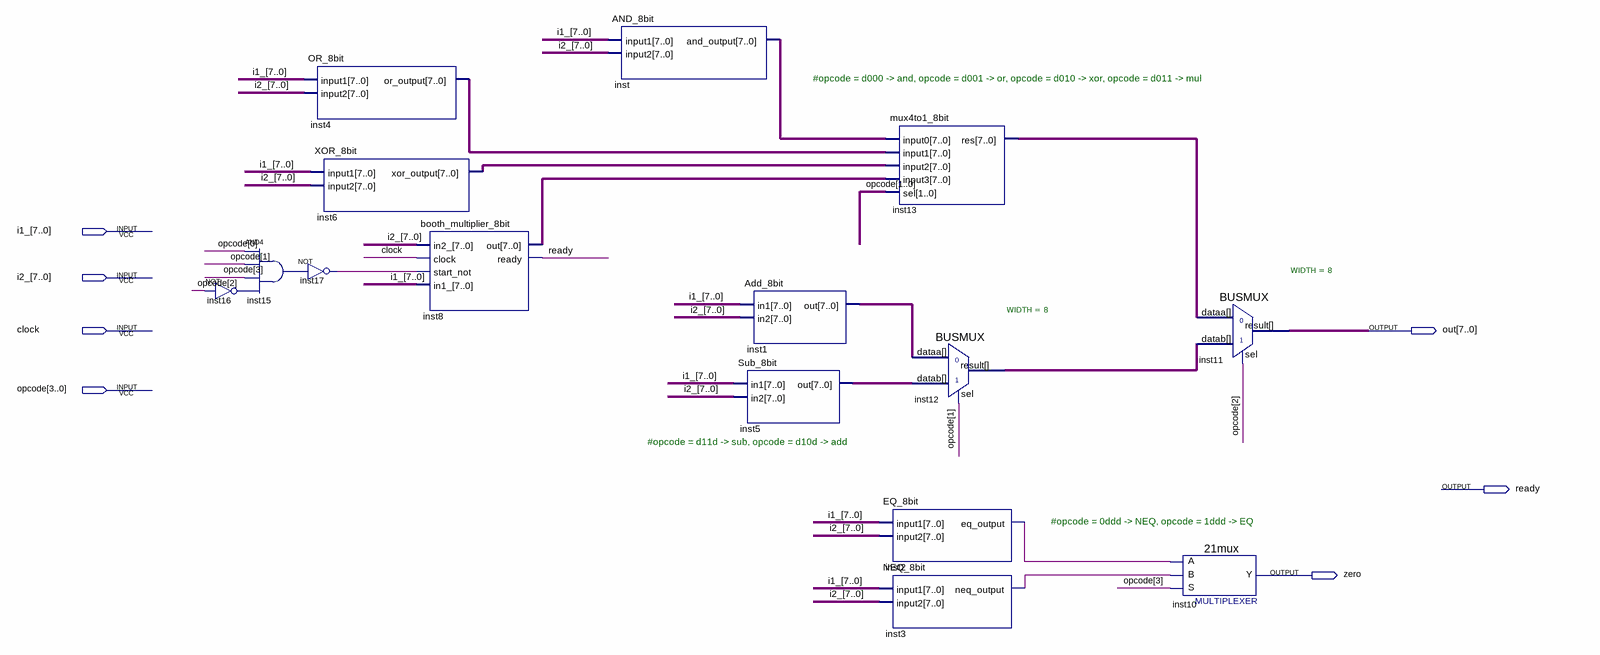
[diagram p0: schematic sheet]
// Quartus schematic myALU.bdf as structural Verilog: 15 symbols, 7 pins
module myALU (
  input  [7:0] i1_,
  input  [7:0] i2_,
  input  clock,
  input  [3:0] opcode,
  output [7:0] out,
  output ready,
  output zero
);

  wire inst2_eq_output, inst3_neq_output, inst15_out, inst16_out, inst17_out;
  wire [7:0] inst1_out, inst4_or_output, inst5_out, inst6_xor_output, inst8_out, inst12_result, inst13_res,
       inst_and_output;

  and inst15 (inst15_out, opcode[0], opcode[1], opcode[3], inst16_out);
  not inst16 (inst16_out, opcode[2]);
  not inst17 (inst17_out, inst15_out);
  OR_8bit inst4 (.input1(i1_), .input2(i2_), .or_output(inst4_or_output));
  XOR_8bit inst6 (.input1(i1_), .input2(i2_), .xor_output(inst6_xor_output));
  booth_multiplier_8bit inst8 (
    .in2_(i2_), .clock(clock), .start_not(inst17_out), .in1_(i1_), .out(inst8_out), .ready(ready));
  AND_8bit inst (.input1(i1_), .input2(i2_), .and_output(inst_and_output));
  Add_8bit inst1 (.in1(i1_), .in2(i2_), .out(inst1_out));
  Sub_8bit inst5 (.in1(i1_), .in2(i2_), .out(inst5_out));
  EQ_8bit inst2 (.input1(i1_), .input2(i2_), .eq_output(inst2_eq_output));
  NEQ_8bit inst3 (.input1(i1_), .input2(i2_), .neq_output(inst3_neq_output));
  mux4to1_8bit inst13 (
    .input0(inst_and_output), .input1(inst4_or_output), .input2(inst6_xor_output), .input3(inst8_out),
    .sel(opcode[1:0]), .res(inst13_res));
  BUSMUX #(.WIDTH(8)) inst12 (.datab(inst5_out), .sel(opcode[1]), .dataa(inst1_out), .result(inst12_result));
  BUSMUX #(.WIDTH(8)) inst11 (.datab(inst12_result), .sel(opcode[2]), .dataa(inst13_res), .result(out));
  \21mux  inst10 (.S(opcode[3]), .B(inst3_neq_output), .A(inst2_eq_output), .Y(zero));

  // Notes on the sheet:
  //   #opcode = d000 -> and, opcode = d001 -> or, opcode = d010 -> xor, opcode = d011 -> mul 
  //   #opcode = d11d -> sub, opcode = d10d -> add
  //   #opcode = 0ddd -> NEQ, opcode = 1ddd -> EQ
endmodule
